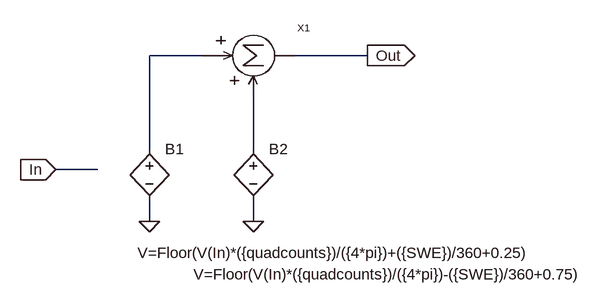
[diagram p0: schematic Encoder.asc]
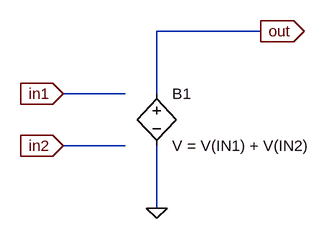
[diagram p1: sub-circuit adder.asc]
Encoder.asc, the LTspice schematic file:
Version 4
SHEET 1 1420 680
WIRE 512 80 432 80
WIRE 768 80 656 80
WIRE 432 224 432 80
WIRE 592 224 592 144
WIRE 352 256 288 256
WIRE 432 336 432 304
WIRE 592 336 592 304
FLAG 288 256 In
IOPIN 288 256 In
FLAG 432 336 0
FLAG 592 336 0
FLAG 768 80 Out
IOPIN 768 80 Out
SYMBOL bv 432 208 R0
WINDOW 3 -18 176 Left 0
SYMATTR Value V=Floor(V(In)*({quadcounts})/({4*pi})+({SWE})/360+0.25)
SYMATTR InstName B1
SYMBOL bv 592 208 R0
WINDOW 3 -92 209 Left 0
SYMATTR Value V=Floor(V(In)*({quadcounts})/({4*pi})-({SWE})/360+0.75)
SYMATTR InstName B2
SYMBOL Adder 592 80 R0
SYMATTR InstName X1

adder.asc, the sub-circuit schematic file:
Version 4
SHEET 1 880 680
WIRE 640 32 480 32
WIRE 432 128 336 128
WIRE 480 128 480 32
WIRE 432 208 336 208
WIRE 480 304 480 208
FLAG 336 208 in2
IOPIN 336 208 In
FLAG 336 128 in1
IOPIN 336 128 In
FLAG 480 304 0
FLAG 640 32 out
IOPIN 640 32 Out
SYMBOL bv 480 112 R0
SYMATTR InstName B1
SYMATTR Value V = V(IN1) + V(IN2)

The netlist it stands for:
* Encoder.asc
B1 N001 0 V=Floor(V(In)*({quadcounts})/({4*pi})+({SWE})/360+0.25)
B2 N002 0 V=Floor(V(In)*({quadcounts})/({4*pi})-({SWE})/360+0.75)
XX1 N001 N002 Out adder

* block symbol definitions
.subckt adder in1 in2 out
B1 out 0 V = V(IN1) + V(IN2)
.ends adder

.backanno
.end